# Altium schematic sheet RA08T.SchDoc
size 209 x 297 mm; SheetNumber: 1; SheetTotal: 1; SPICEModelCacheXSTIBOJF: <root> / <DocumentId>XSTIBOJF</DocumentId> / </root>
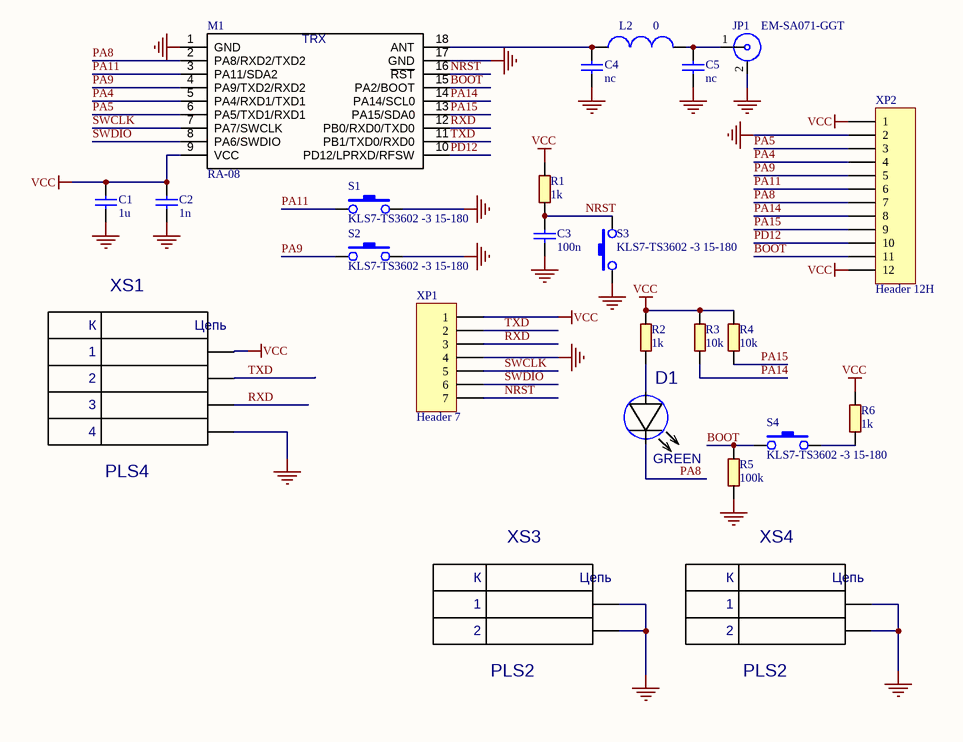
[diagram p0: RA08T.SchDoc]

## Parts
C1  1u  [C-0603]
C2  1n  [C-0603]
C3  100n  [C-0603]
C4  nc  [C-0603]
C5  nc  [C-0603]
D1  value GREEN  [LED_3mm_RED]  (hidden comment: LED3mm)
JP1  EM-SA071-GGT  [AMPHENOL_132357-11]
L2  0  [L-0603]
M1  RA-08  [LGA18_RA08]
R1  1k  [R-0603]
R2  1k  [R-0603]
R3  10k  [R-0603]
R4  10k  [R-0603]
R5  100k  [R-0603]
R6  1k  [R-0603]
S1  KLS7-TS3602 -3 15-180  [BUTT_MIN]
S2  KLS7-TS3602 -3 15-180  [BUTT_MIN]
S3  KLS7-TS3602 -3 15-180  [BUTT_MIN]
S4  KLS7-TS3602 -3 15-180  [BUTT_MIN]
XP1  Header 7  [PLS1-7R]
XP2  Header 12H  [HDR1X12H_1]
XS1  PLS4  [PLS4 - 3D]
XS3  PLS2  [PLS2 - 3D]
XS4  PLS2  [PLS2 - 3D]

## Nets
GND: C1.2 C2.2 C3.2 C4.2 C5.2 JP1.2 M1.1(GND) M1.17(GND) R5.2 S1.2 S2.2 S3.1 XP1.4 XP2.2 XS1.4 XS3.1 XS3.2 XS4.1 XS4.2
VCC: C1.1 C2.1 M1.9(VCC) R1.2 R2.2 R3.2 R4.2 R6.1 XP1.1 XP2.1 XP2.12 XS1.1
BOOT: M1.15(PA2/BOOT) R5.1 S4.1 XP2.11
NRST: C3.1 M1.16(~{RST}) R1.1 S3.2 XP1.7
PA4: M1.5(PA4/RXD1/TXD1) XP2.4
PA5: M1.6(PA5/TXD1/RXD1) XP2.3
PA8: D1.2 M1.2(PA8/RXD2/TXD2) XP2.7
PA9: M1.4(PA9/TXD2/RXD2) S2.1 XP2.5
PA11: M1.3(PA11/SDA2) S1.1 XP2.6
PA14: M1.14(PA14/SCL0) R3.1 XP2.8
PA15: M1.13(PA15/SDA0) R4.1 XP2.9
PD12: M1.10(PD12/LPRXD/RFSW) XP2.10
RXD: M1.12(PB0/RXD0/TXD0) XP1.3 XS1.3
SWCLK: M1.7(PA7/SWCLK) XP1.5
SWDIO: M1.8(PA6/SWDIO) XP1.6
TXD: M1.11(PB1/TXD0/RXD0) XP1.2 XS1.2
NetC4_1: C4.1 L2.1 M1.18(ANT)
NetC5_1: C5.1 JP1.1 L2.2
NetD1_1: D1.1 R2.1
NetR6_2: R6.2 S4.2

## Notes on the sheet
- Перв. примен.
- Справ. №
- Подп. и дата
- Инв. № дубл.
- Взам. инв. №
- Изм.
- Лист
- № докум.
- Подп.
- Дата
- Лит.
- Масса
- Масштаб
- Т.контр.
- Пров.
- Разраб.
- Листов
- Инв. № подл.
- Н.контр.
- Утв.
- Копировал
- Формат А4
- (in symbol PLS2) К; Цепь
- (in symbol PLS4) К; Цепь
- (in symbol RA-08) TRX

## Library data of the parts
C1-C5 = CAPN: Voltage: 50V; Точність/група: NP0; Вид: Конденсатор
D1 = LED3mm: Mounting  Method: THT
JP1 = SMA: SMA Female R/A PCB Mount; Вид: Роз'єм
L2 = L: Вид: Індуктивність
R1-R6 = RES: Точність/група: 5%; Вид: Резистор
S1-S4 = SW-1: Вид: Кнопка; Робоча напруга: *
XP1 = Header 7: Header, 7-Pin; LatestRevisionDate: 17-Jul-2002; LatestRevisionNote: Re-released for DXP Platform.; Publisher: Altium Limited
XP2 = Header 12H: Header, 12-Pin, Right Angle; LatestRevisionDate: 17-Jul-2002; LatestRevisionNote: Re-released for DXP Platform.; Publisher: Altium Limited
XS1 = PLS4: Value: {Value}; Mounting  Method: THT
XS3 XS4 = PLS2: Value: {Value}; Mounting  Method: THT